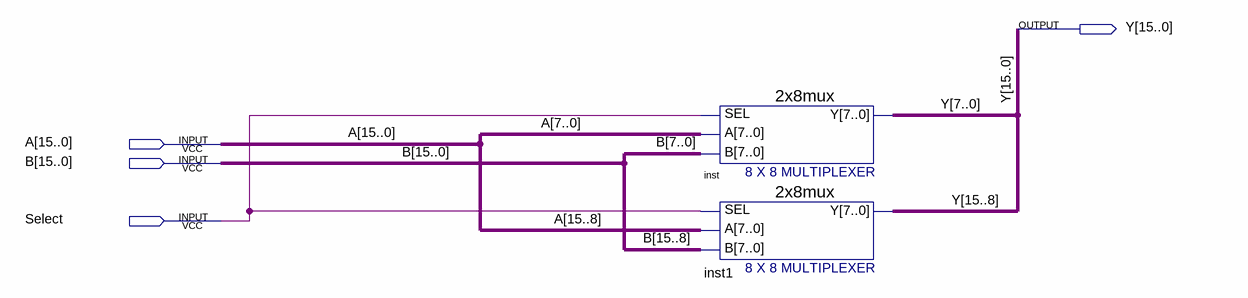
[diagram p0: schematic sheet]
// Quartus schematic 2X16Mux.bdf as structural Verilog: 2 symbols, 4 pins
module \2X16Mux  (
  input  [15:0] A,
  input  [15:0] B,
  input  Select,
  output [15:0] Y
);

  \2x8mux  inst (.SEL(Select), .A(A[7:0]), .B(B[7:0]), .Y(Y[7:0]));
  \2x8mux  inst1 (.SEL(Select), .A(A[15:8]), .B(B[15:8]), .Y(Y[15:8]));
endmodule
